# Altium schematic sheet rev02_19.SchDoc
size 282 x 200 mm
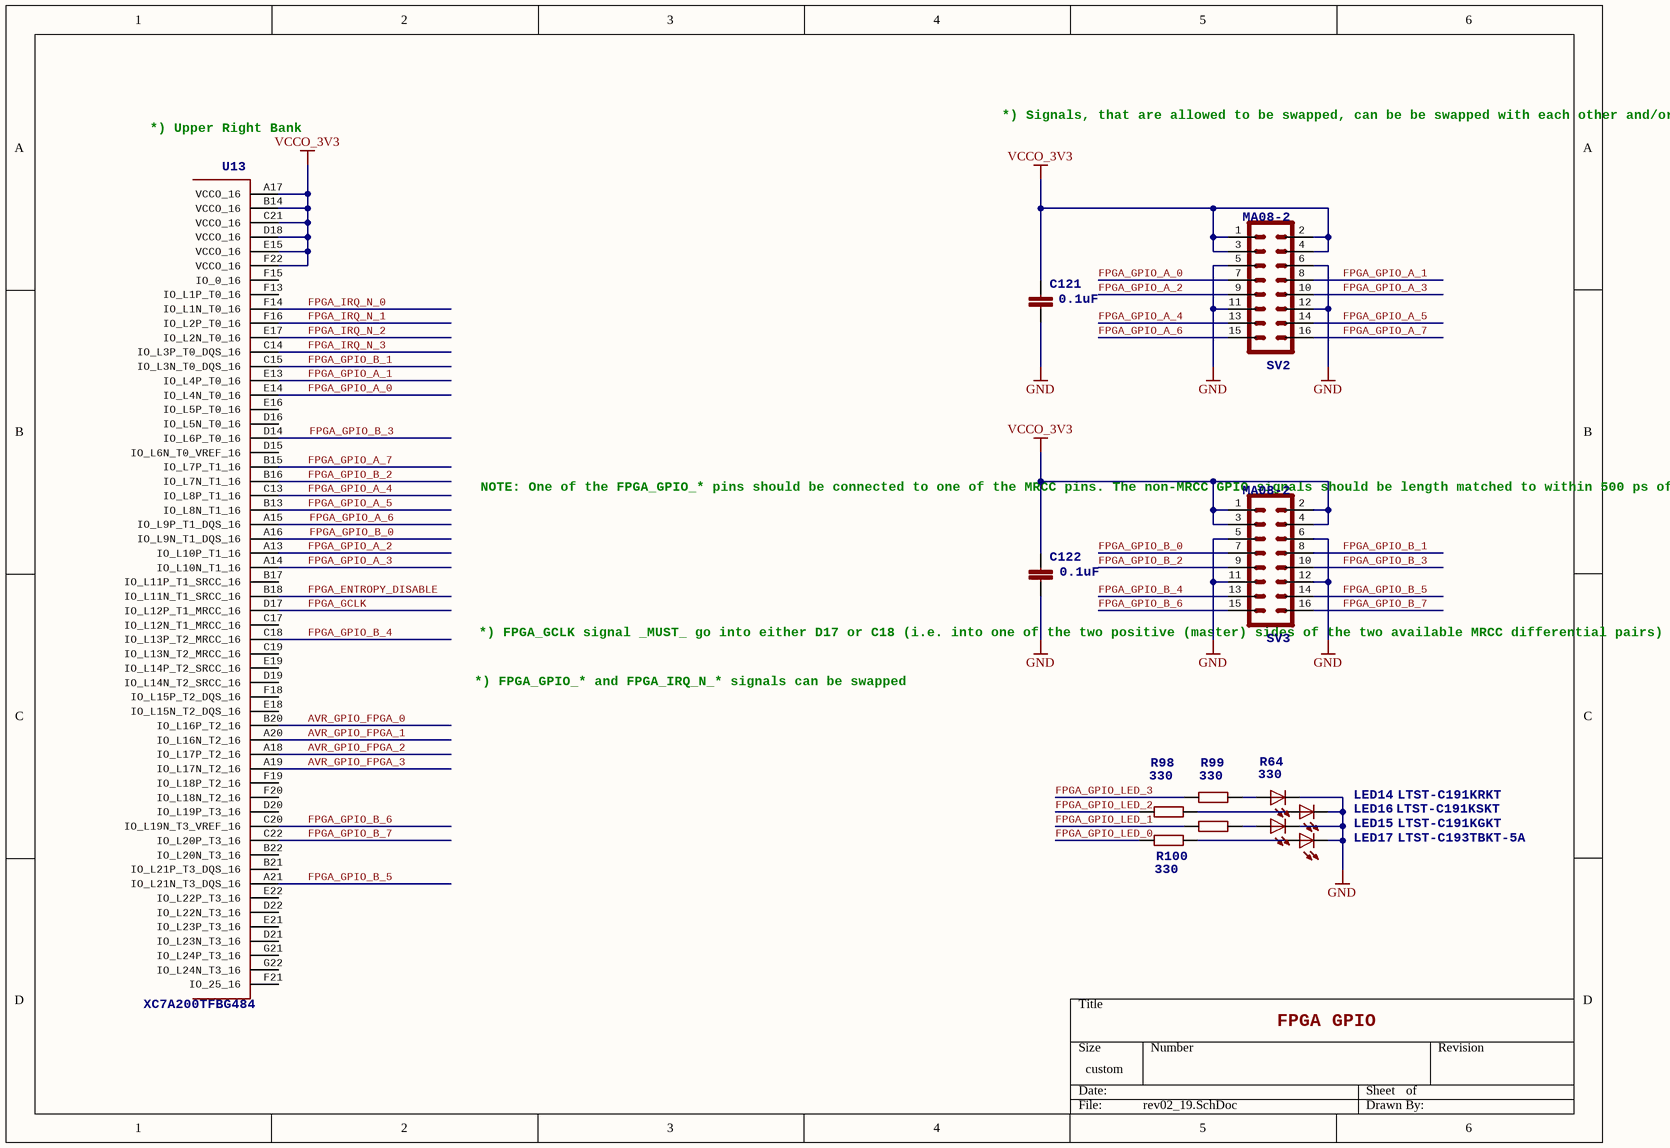
[diagram p0: rev02_19.SchDoc]

## Parts
C121  value 0.1uF  >NAME: C121  [C_0402]
C122  value 0.1uF  >NAME: C122  [C_0402]
LED14  LTST-C191KRKT  [VD_0603]
LED15  LTST-C191KGKT  [VD_0603]
LED16  LTST-C191KSKT  [VD_0603]
LED17  LTST-C193TBKT-5A  [VD_0603]
R64  value 330  [R_0402]
R98  value 330  [R_0402]
R99  value 330  [R_0402]
R100  value 330  [R_0402]
SV2  >NAME: SV2  [PLD-16]  (hidden comment: MA08-2)
SV3  >NAME: SV3  [PLD-16]  (hidden comment: MA08-2)
U13  >NAME: U13  [BGA484C100P22X22_2300X2300X254]  (hidden comment: XC7A200TFBG484)  (part E of 17)

## Nets
GND: C121.2 C122.2 LED14.2(C) LED15.2(C) LED16.2(C) LED17.2(C) SV2.5 SV2.6 SV2.11 SV2.12 SV3.5 SV3.6 SV3.11 SV3.12
VCCO_3V3: C121.1 C122.1 SV2.1 SV2.2 SV2.3 SV2.4 SV3.1 SV3.2 SV3.3 SV3.4 U13.A17(VCCO_16) U13.B14(VCCO_16) U13.C21(VCCO_16) U13.D18(VCCO_16) U13.E15(VCCO_16) U13.F22(VCCO_16)
AVR_GPIO_FPGA_0: U13.B20(IO_L16P_T2_16)
AVR_GPIO_FPGA_1: U13.A20(IO_L16N_T2_16)
AVR_GPIO_FPGA_2: U13.A18(IO_L17P_T2_16)
AVR_GPIO_FPGA_3: U13.A19(IO_L17N_T2_16)
FPGA_ENTROPY_DISABLE: U13.B18(IO_L11N_T1_SRCC_16)
FPGA_GCLK: U13.D17(IO_L12P_T1_MRCC_16)
FPGA_GPIO_A_0: SV2.7 U13.E14(IO_L4N_T0_16)
FPGA_GPIO_A_1: SV2.8 U13.E13(IO_L4P_T0_16)
FPGA_GPIO_A_2: SV2.9 U13.A13(IO_L10P_T1_16)
FPGA_GPIO_A_3: SV2.10 U13.A14(IO_L10N_T1_16)
FPGA_GPIO_A_4: SV2.13 U13.C13(IO_L8P_T1_16)
FPGA_GPIO_A_5: SV2.14 U13.B13(IO_L8N_T1_16)
FPGA_GPIO_A_6: SV2.15 U13.A15(IO_L9P_T1_DQS_16)
FPGA_GPIO_A_7: SV2.16 U13.B15(IO_L7P_T1_16)
FPGA_GPIO_B_0: SV3.7 U13.A16(IO_L9N_T1_DQS_16)
FPGA_GPIO_B_1: SV3.8 U13.C15(IO_L3N_T0_DQS_16)
FPGA_GPIO_B_2: SV3.9 U13.B16(IO_L7N_T1_16)
FPGA_GPIO_B_3: SV3.10 U13.D14(IO_L6P_T0_16)
FPGA_GPIO_B_4: SV3.13 U13.C18(IO_L13P_T2_MRCC_16)
FPGA_GPIO_B_5: SV3.14 U13.A21(IO_L21N_T3_DQS_16)
FPGA_GPIO_B_6: SV3.15 U13.C20(IO_L19N_T3_VREF_16)
FPGA_GPIO_B_7: SV3.16 U13.C22(IO_L20P_T3_16)
FPGA_GPIO_LED_0: R100.2
FPGA_GPIO_LED_1: R64.2
FPGA_GPIO_LED_2: R98.2
FPGA_GPIO_LED_3: R99.2
FPGA_IRQ_N_0: U13.F14(IO_L1N_T0_16)
FPGA_IRQ_N_1: U13.F16(IO_L2P_T0_16)
FPGA_IRQ_N_2: U13.E17(IO_L2N_T0_16)
FPGA_IRQ_N_3: U13.C14(IO_L3P_T0_DQS_16)
NetLED14_1: LED14.1(A) R99.1
NetLED15_1: LED15.1(A) R64.1
NetLED16_1: LED16.1(A) R98.1
NetLED17_1: LED17.1(A) R100.1

Not connected (* = marked no-connect by the designer): U13 B17(IO_L11P_T1_SRCC_16) B21(IO_L21P_T3_DQS_16) B22(IO_L20N_T3_16) C17(IO_L12N_T1_MRCC_16) C19(IO_L13N_T2_MRCC_16) D15(IO_L6N_T0_VREF_16) D16(IO_L5N_T0_16) D19(IO_L14N_T2_SRCC_16) D20(IO_L19P_T3_16) D21(IO_L23N_T3_16) D22(IO_L22N_T3_16) E16(IO_L5P_T0_16) E18(IO_L15N_T2_DQS_16) E19(IO_L14P_T2_SRCC_16) E21(IO_L23P_T3_16) E22(IO_L22P_T3_16) F13(IO_L1P_T0_16) F15(IO_0_16) F18(IO_L15P_T2_DQS_16) F19(IO_L18P_T2_16) F20(IO_L18N_T2_16) F21(IO_25_16) G21(IO_L24P_T3_16) G22(IO_L24N_T3_16)

## Notes on the sheet
- *) Upper Right Bank
- *) Signals, that are allowed to be swapped, can be be swapped
  with each other and/or moved to different pins within their bank.
- (near SV3) NOTE: One of the FPGA_GPIO_* pins
  should be connected to one of the
  MRCC pins.
  The non-MRCC GPIO signals should be
  length matched to within 500 ps of
  the MRCC signal.
- (near SV3) *) FPGA_GCLK signal _MUST_ go into either D17 or C18
  (i.e. into one of the two positive (master) sides
  of the two available MRCC differential pairs)
- *) FPGA_GPIO_* and FPGA_IRQ_N_* signals can be swapped
- FPGA GPIO

## Library data of the parts
C121 C122 = C-EUC0402: 0402 CAPACITOR; DIELECTRIC: X7R; RATED_VOLTAGE: 50V; TOLERANCE: 10%; >VALUE: 0.1 uF
LED14 = LEDCHIP-LED0603: RED LED
LED15 = LEDCHIP-LED0603: GREEN LED
LED16 = LEDCHIP-LED0603: YELLOW LED
LED17 = LEDCHIP-LED0603: BLUE LED
R64 R98-R100 = R-EU_R0402: 0402 Resistor 5%
SV2 SV3 = MA08-2: PIN HEADER 0.1"; OC_FARNELL: unknown; OC_NEWARK: unknown; >VALUE: MA08-2
U13 = XC7A200TFBG484: Xilinx FPGA: XC7A200TFBG484; MPN: XC7A200T-1FBG484C; MFR: Xilinx; OC_DIGIKEY: 122-1871-ND; >VALUE: XC7A200TFBG484